# Altium schematic sheet BlockDiagram.SchDoc
size A4
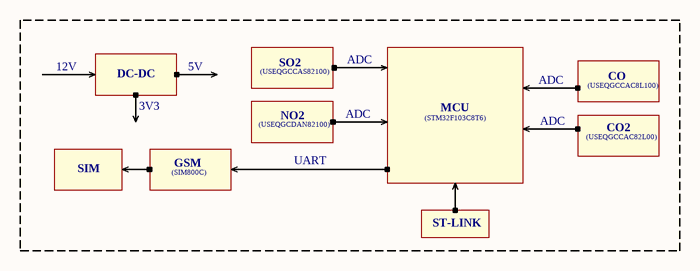
[diagram p0: BlockDiagram.SchDoc]

## Notes on the sheet
- 12V
- DC-DC
- 3V3
- 5V
- (USEQGCDAN82100)
- (USEQGCCAS82100)
- SO2
- NO2
- ADC
- (STM32F103C8T6)
- MCU
- (USEQGCCAC8L100)
- CO2
- CO
- SIM
- (SIM800C)
- GSM
- UART
- (USEQGCCAC82L00)
- ST-LINK